# EAGLE design thermocouple_v0.1 (EAGLE 6.6.0)
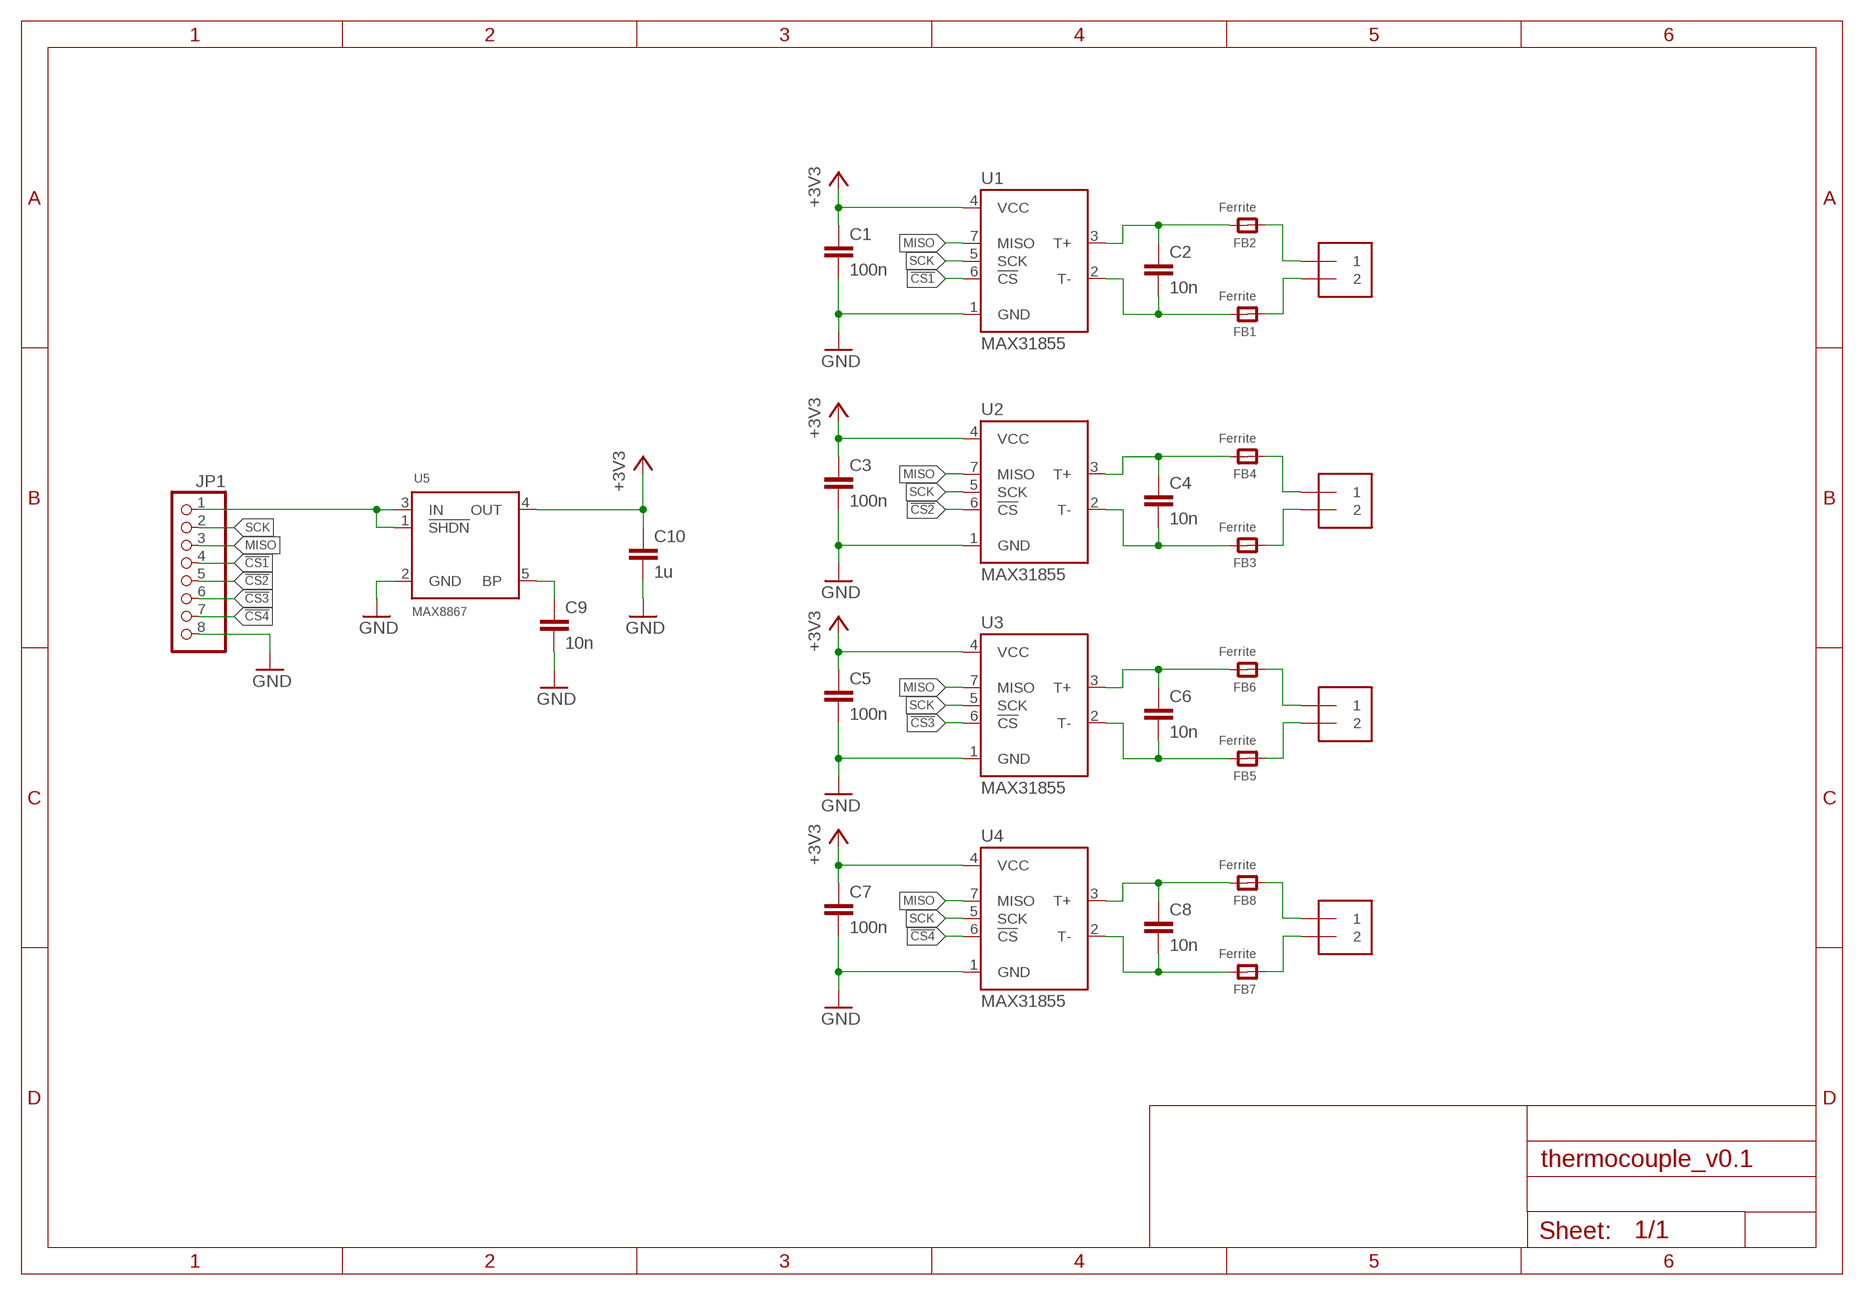
[diagram p0: schematic, sheet 1]

## Parts
C1  100n  C-EUC0603  [C0603]
C2  10n  C-EUC0603  [C0603]
C3  100n  C-EUC0603  [C0603]
C4  10n  C-EUC0603  [C0603]
C5  100n  C-EUC0603  [C0603]
C6  10n  C-EUC0603  [C0603]
C7  100n  C-EUC0603  [C0603]
C8  10n  C-EUC0603  [C0603]
C9  10n  C-EUC0603  [C0603]
C10  1u  C-EUC0603  [C0603]
FB1  Ferrite  FERRITE_0805  [_0805]
FB2  Ferrite  FERRITE_0805  [_0805]
FB3  Ferrite  FERRITE_0805  [_0805]
FB4  Ferrite  FERRITE_0805  [_0805]
FB5  Ferrite  FERRITE_0805  [_0805]
FB6  Ferrite  FERRITE_0805  [_0805]
FB7  Ferrite  FERRITE_0805  [_0805]
FB8  Ferrite  FERRITE_0805  [_0805]
J1  1X2-3.5MM  [1X2-3.5MM]
J2  1X2-3.5MM  [1X2-3.5MM]
J3  1X2-3.5MM  [1X2-3.5MM]
J4  1X2-3.5MM  [1X2-3.5MM]
JP1  PINHD-1X8  [1X08]
U1  MAX31855  [SO08]
U2  MAX31855  [SO08]
U3  MAX31855  [SO08]
U4  MAX31855  [SO08]
U5  MAX8867  [SOT23-5L]

## Nets
!CS1: JP1.4 U1.6(!CS)
!CS2: JP1.5 U2.6(!CS)
!CS3: JP1.6 U3.6(!CS)
!CS4: JP1.7 U4.6(!CS)
+3V3: C1.1 C3.1 C5.1 C7.1 C10.1 U1.4(VCC) U2.4(VCC) U3.4(VCC) U4.4(VCC) U5.4(OUT)
GND: C1.2 C3.2 C5.2 C7.2 C9.2 C10.2 JP1.8 U1.1(GND) U2.1(GND) U3.1(GND) U4.1(GND) U5.2(GND)
MISO: JP1.3 U1.7(MISO) U2.7(MISO) U3.7(MISO) U4.7(MISO)
N$1: FB1.1 J1.2
N$3: C2.2 FB1.2 U1.2(T-)
N$4: FB3.1 J2.2
N$5: FB2.1 J1.1
N$6: C2.1 FB2.2 U1.3(T+)
N$7: FB4.1 J2.1
N$8: C4.1 FB4.2 U2.3(T+)
N$9: C4.2 FB3.2 U2.2(T-)
N$10: FB5.1 J3.2
N$11: FB6.1 J3.1
N$12: C6.1 FB6.2 U3.3(T+)
N$13: C6.2 FB5.2 U3.2(T-)
N$14: FB7.1 J4.2
N$15: FB8.1 J4.1
N$16: C8.1 FB8.2 U4.3(T+)
N$17: C8.2 FB7.2 U4.2(T-)
N$18: C9.1 U5.5(BP)
N$19: JP1.1 U5.1(!SHDN) U5.3(IN)
SCK: JP1.2 U1.5(SCK) U2.5(SCK) U3.5(SCK) U4.5(SCK)

## Library data of the parts
C1-C10 = rcl:C-EU: CAPACITOR, European symbol
FB1-FB8 = microbuilder:FERRITE: Ferrite Bead 0603 MMZ1608B121C - 120 Ohm @ 100MHz, 600mA, 0.15 Ohm DC Resistance - Digikey: 445-2164-1-ND BK1608HW121-T - 120 Ohm, 600mA Ferrite Chip - Digikey: 587-1876-2-ND 0805 HZ0805B272R-10 - 2.7K Ohm @ 100MHz, 200mA, 0.8 Ohm DC Resistance - Digikey: 240-2504-1-ND (see also Murata BLM21BD272SN1L) MMZ2012Y152B - 1.5K Ohm @ 100MHz, 500mA, 0.4 Ohm DC Resistance - Digikey: 445-1560-1-ND - Mainly for high frequency (80-400MHz) MMZ2012R102A - 1K Ohm @ 100MHz, 500mA, 0.3 Ohm DC Resistance - Digikey: 445-1555-2-ND - More general purpose (10-200MHz)
J1-J4 = adafruit:1X2: 3.5mm Terminal block http://www.ladyada.net/library/pcb/eaglelibrary.html
JP1 = pinhead:PINHD-1X8: PIN HEADER
U1-U4 = maxim:MAX31855: Cold-Junction Compensated Thermocouple-to-Digital Converter
U5 = maxim:MAX8867

## Board
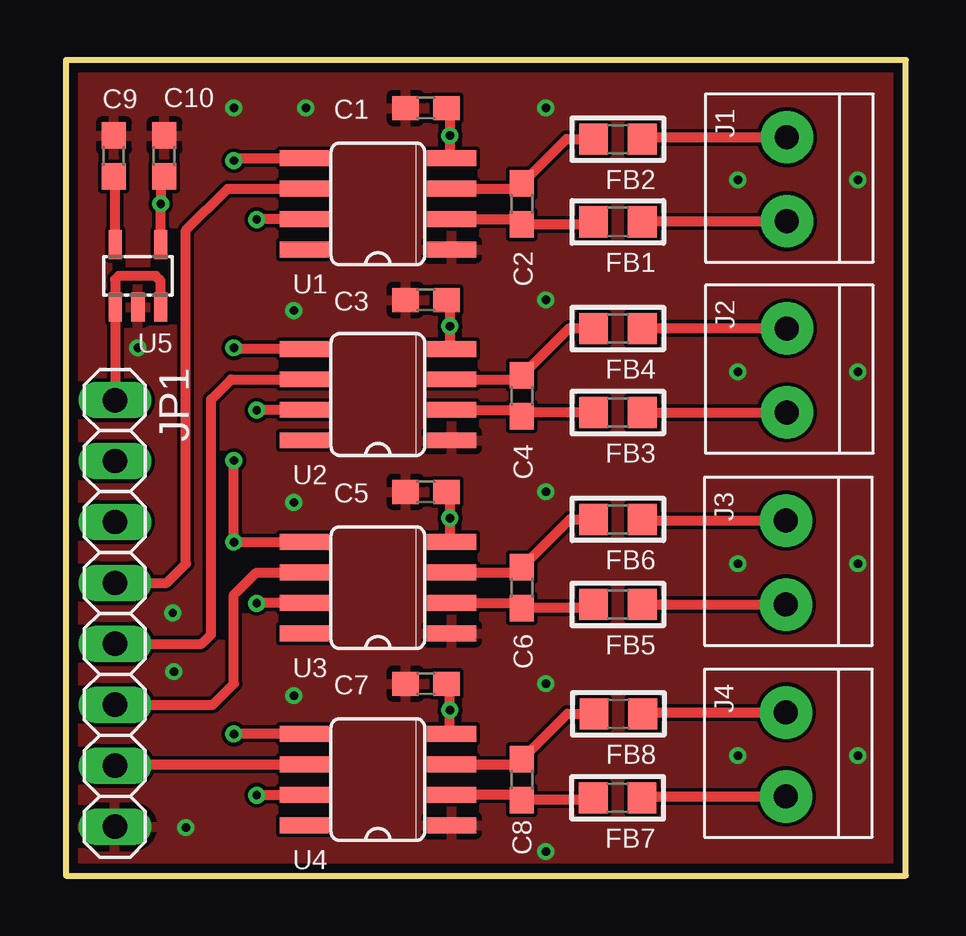
[diagram p1: board, top side]
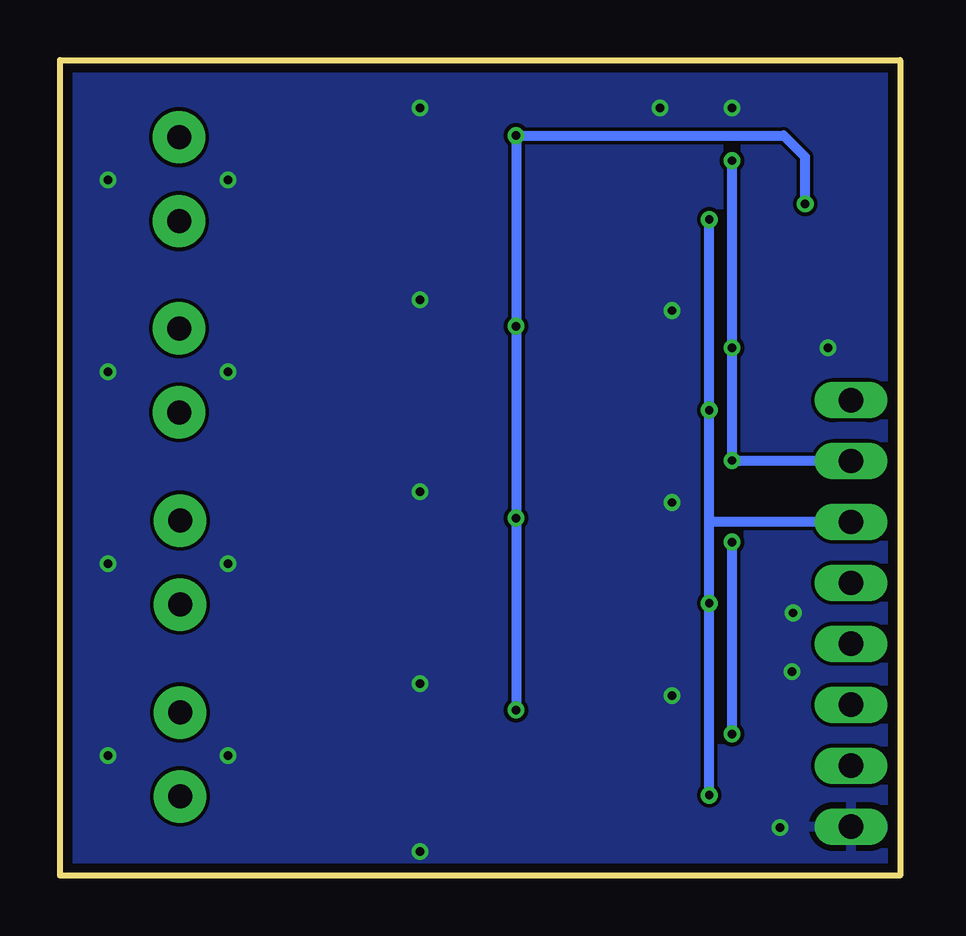
[diagram p2: board, bottom side, seen from below]

Size 35 x 34 mm. Coordinates in mm from the lower left corner, seen from the top.
Outline: 0,0 35,0 35,34 0,34 0,0
Copper layers (1*16): Top 0.0356mm / dielectric 1.5011mm / Bottom 0.0356mm
Design rules "oshPark2Layer *": minimum track width 6mil, minimum drill 13mil, track to track 6mil, track to pad 6mil, pad to pad 6mil, via to via 6mil, smd to smd 6mil, copper to edge 15mil, drill to drill 6mil, minimum pad ring 7mil, minimum via ring 7mil, stop-mask expansion 3mil, vias tented up to drill 20mil, thermal gap 10mil

### Footprints (pad centres in the part's own frame; a part is rotated, then mirrored left to right if it is on the bottom)
C0603 = smd 1.1 x 1: 1 -0.85,0; 2 0.85,0
_0805 = smd 1.2 x 1.3: 1 -1.016,0; 2 1.016,0
1X2-3.5MM = drill 1 pad 2.184: 1 1.8,0; 2 -1.7,0
1X08 = drill 1.016 long: 1 -8.89,0; 2 -6.35,0; 3 -3.81,0; 4 -1.27,0; 5 1.27,0; 6 3.81,0; 7 6.35,0; 8 8.89,0
SO08 = smd 0.66 x 2.032: 1 -1.905,-3.073; 2 -0.635,-3.073; 3 0.635,-3.073; 4 1.905,-3.073; 5 1.905,3.073; 6 0.635,3.073; 7 -0.635,3.073; 8 -1.905,3.073
SOT23-5L = smd 0.55 x 1.2: 1 -0.95,-1.3; 2 0,-1.3; 3 0.95,-1.3; 4 0.95,1.3; 5 -0.95,1.3

### Placement (x,y rotation side)
C1  15,32 180 top
C2  19,28 270 top
C3  15,24 180 top
C4  19,20 270 top
C5  15,16 180 top
C6  19,12 270 top
C7  15,8 180 top
C8  19,4 270 top
C9  2,30 90 top
C10  4.1,30 90 top
FB1  23,27.25 180 top
FB2  23,30.7 180 top
FB3  23,19.3 180 top
FB4  23,22.8 180 top
FB5  23,11.3 180 top
FB6  23,14.85 180 top
FB7  22.99,3.24 180 top
FB8  23.02,6.74 180 top
J1  30.04,28.98 90 top
J2  30.04,21.01 90 top
J3  30,13 90 top
J4  30,5 90 top
JP1  2.04,10.93 270 top
U1  13,28 90 top
U2  13,20.05 90 top
U3  13,12 90 top
U4  13,4 90 top
U5  3,25 0 top

### Tracks (layer width: path | path; a pad name or v marks a point on that pad's centre or on a via)
!CS1
  Top 0.406: JP1.4 4.2,12.2 5,13 5,26.9 6.74,28.64 U1.6
!CS2
  Top 0.406: JP1.5 5.66,9.66 6.05,10.05 6.05,19.85 6.88,20.68 U2.6
!CS3
  Top 0.406: JP1.6 6.12,7.12 7,8 7,11.7 7.93,12.63 U3.6
!CS4
  Top 0.406: JP1.7 2.1,4.63 U4.6
+3V3  (via drill 0.35)
  Top 0.406: U5.4 v3.95,28 3.95,29 C10.1 | U1.4 16,29.98 v16,30.85 16,31.85 C1.1 | U2.4 16,22.03 v16,22.9 16,23.85 C3.1 | U3.4 16,13.98 v16,14.9 16,15.85 C5.1 | C7.1 16,7.85 v16,6.9 16,5.98 U4.4
  Bottom 0.406: v3.95,28 3.95,29.95 4.85,30.85 v16,30.85 v16,22.9 v16,14.9 v16,6.9
GND  (via drill 0.35)
  other vias: 7,32 10,32 3,22 20,32 20,24 20,16 20,8 20,1 28,29 28,21 33,21 33,29 33,13 28,13 28,5 33,5 5,2 9.5,7.5 9.5,15.55 9.5,23.55 4.5,8.5 4.45,10.95
  pour Top: -1,-1 36,-1 36,35 -1,35
  pour Bottom: -2,-2 37,-2 37,36 -2,36
MISO  (via drill 0.35)
  Top 0.406: U4.7 9.91,3.35 v7.95,3.35 | U1.7 7.96,27.36 v7.95,27.35 | U2.7 7.99,19.41 v7.95,19.4 | U3.7 7.96,11.37 v7.95,11.35
  Bottom 0.406: v7.95,3.35 v7.95,11.35 7.95,14.74 | 7.95,14.74 v7.95,19.4 v7.95,27.35 | JP1.3 7.95,14.74
N$1
  Top 0.406: FB1.1 24.05,27.28 J1.2
N$3
  Top 0.406: U1.2 18.79,27.36 C2.2 21.88,27.15 FB1.2
N$4
  Top 0.406: FB3.1 J2.2
N$5
  Top 0.406: FB2.1 24.1,30.78 J1.1
N$6
  Top 0.406: U1.3 18.79,28.64 C2.1 20.85,30.7 FB2.2
N$7
  Top 0.406: J2.1 FB4.1
N$8
  Top 0.406: U2.3 18.84,20.68 C4.1 20.95,22.8 FB4.2
N$9
  Top 0.406: FB3.2 19.15,19.3 C4.2 18.73,19.41 U2.2
N$10
  Top 0.406: FB5.1 J3.2
N$11
  Top 0.406: FB6.1 24.07,14.8 J3.1
N$12
  Top 0.406: U3.3 18.79,12.63 C6.1 21,14.85 FB6.2
N$13
  Top 0.406: FB5.2 21.83,11.15 C6.2 18.79,11.37 U3.2
N$14
  Top 0.406: FB7.1 24.07,3.3 J4.2
N$15
  Top 0.406: FB8.1 24.1,6.8 J4.1
N$16
  Top 0.406: U4.3 18.79,4.63 C8.1 20.89,6.74 FB8.2
N$17
  Top 0.406: FB7.2 21.88,3.15 C8.2 18.79,3.37 U4.2
N$18
  Top 0.406: U5.5 2.05,29.1 C9.1
N$19
  Top 0.406: JP1.1 U5.1 2.05,24.85 2.2,25 3.75,25 3.95,24.8 U5.3
SCK  (via drill 0.35)
  Top 0.406: U3.5 7.09,13.9 v7,13.9 v7,17.3 | U4.5 v7,5.9 | v7,29.8 7.09,29.91 U1.5 | U2.5 7.04,21.95 v7,22
  Bottom 0.406: v7,5.9 v7,13.9 | v7,29.8 v7,22 v7,17.3 6.72,17.28 JP1.2